# Altium schematic sheet Ledsor.SchDoc: LED Matrix
size A4; Author: Bencsik Dániel Zoltán; Organization: BME-AUT; DocumentNumber: 4; Revision: A7; SheetNumber: 4; SheetTotal: 4
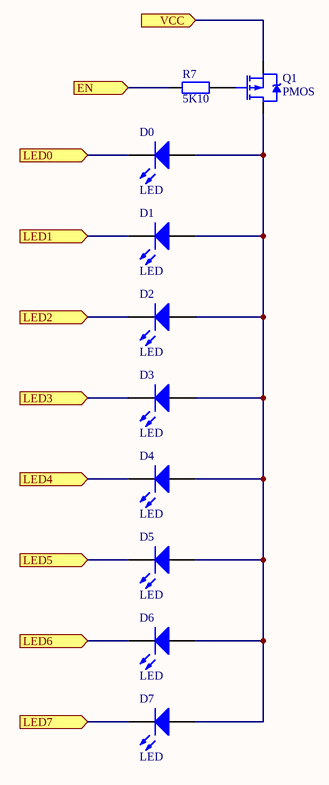
[diagram p0: Ledsor.SchDoc]

## Parts
D0  LED  [HF_FP_0805_LED_BLUE]
D1  LED  [HF_FP_0805_LED_BLUE]
D2  LED  [HF_FP_0805_LED_BLUE]
D3  LED  [HF_FP_0805_LED_BLUE]
D4  LED  [HF_FP_0805_LED_BLUE]
D5  LED  [HF_FP_0805_LED_BLUE]
D6  LED  [HF_FP_0805_LED_BLUE]
D7  LED  [HF_FP_0805_LED_BLUE]
Q1  PMOS  [FP_SOT23-3]
R7  5K10  [HF_FP_0603_RES]

## Ports
EN (in), LED0 (in), LED1 (in), LED2 (in), LED3 (in), LED4 (in), LED5 (in), LED6 (in), LED7 (in), VCC (in)

## Nets
EN: R7.1 ; port EN
LED0: D0.K ; port LED0
LED1: D1.K ; port LED1
LED2: D2.K ; port LED2
LED3: D3.K ; port LED3
LED4: D4.K ; port LED4
LED5: D5.K ; port LED5
LED6: D6.K ; port LED6
LED7: D7.K ; port LED7
VCC: Q1.2(S) ; port VCC
NetD0_A: D0.A D1.A D2.A D3.A D4.A D5.A D6.A D7.A Q1.3(D)
NetQ1_1: Q1.1(G) R7.2

## Notes on the sheet
- Title
- Size:
- Date:
- A4
- Number:
- Time:
- Revision:
- Sheet
- of
- File:

## Library data of the parts
D0-D7 = LED: Typical RED GaAs LED
Q1 = PMOS: MOSFET, P CH; Name: BSS84AK (NXP) P-FET 50V 0.18A <7.5R SOT-23 ˝VS˝; Supplier: Lomex; Reference: 86-05-45
R7 = RES: Resistor; Name: 5K10 0603 5% WR06X512JTL 0.1W (WAL); Supplier: Lomex; Reference: 81-28-96; Value: 5K10